# EAGLE schematic template (EAGLE 7.0.0)
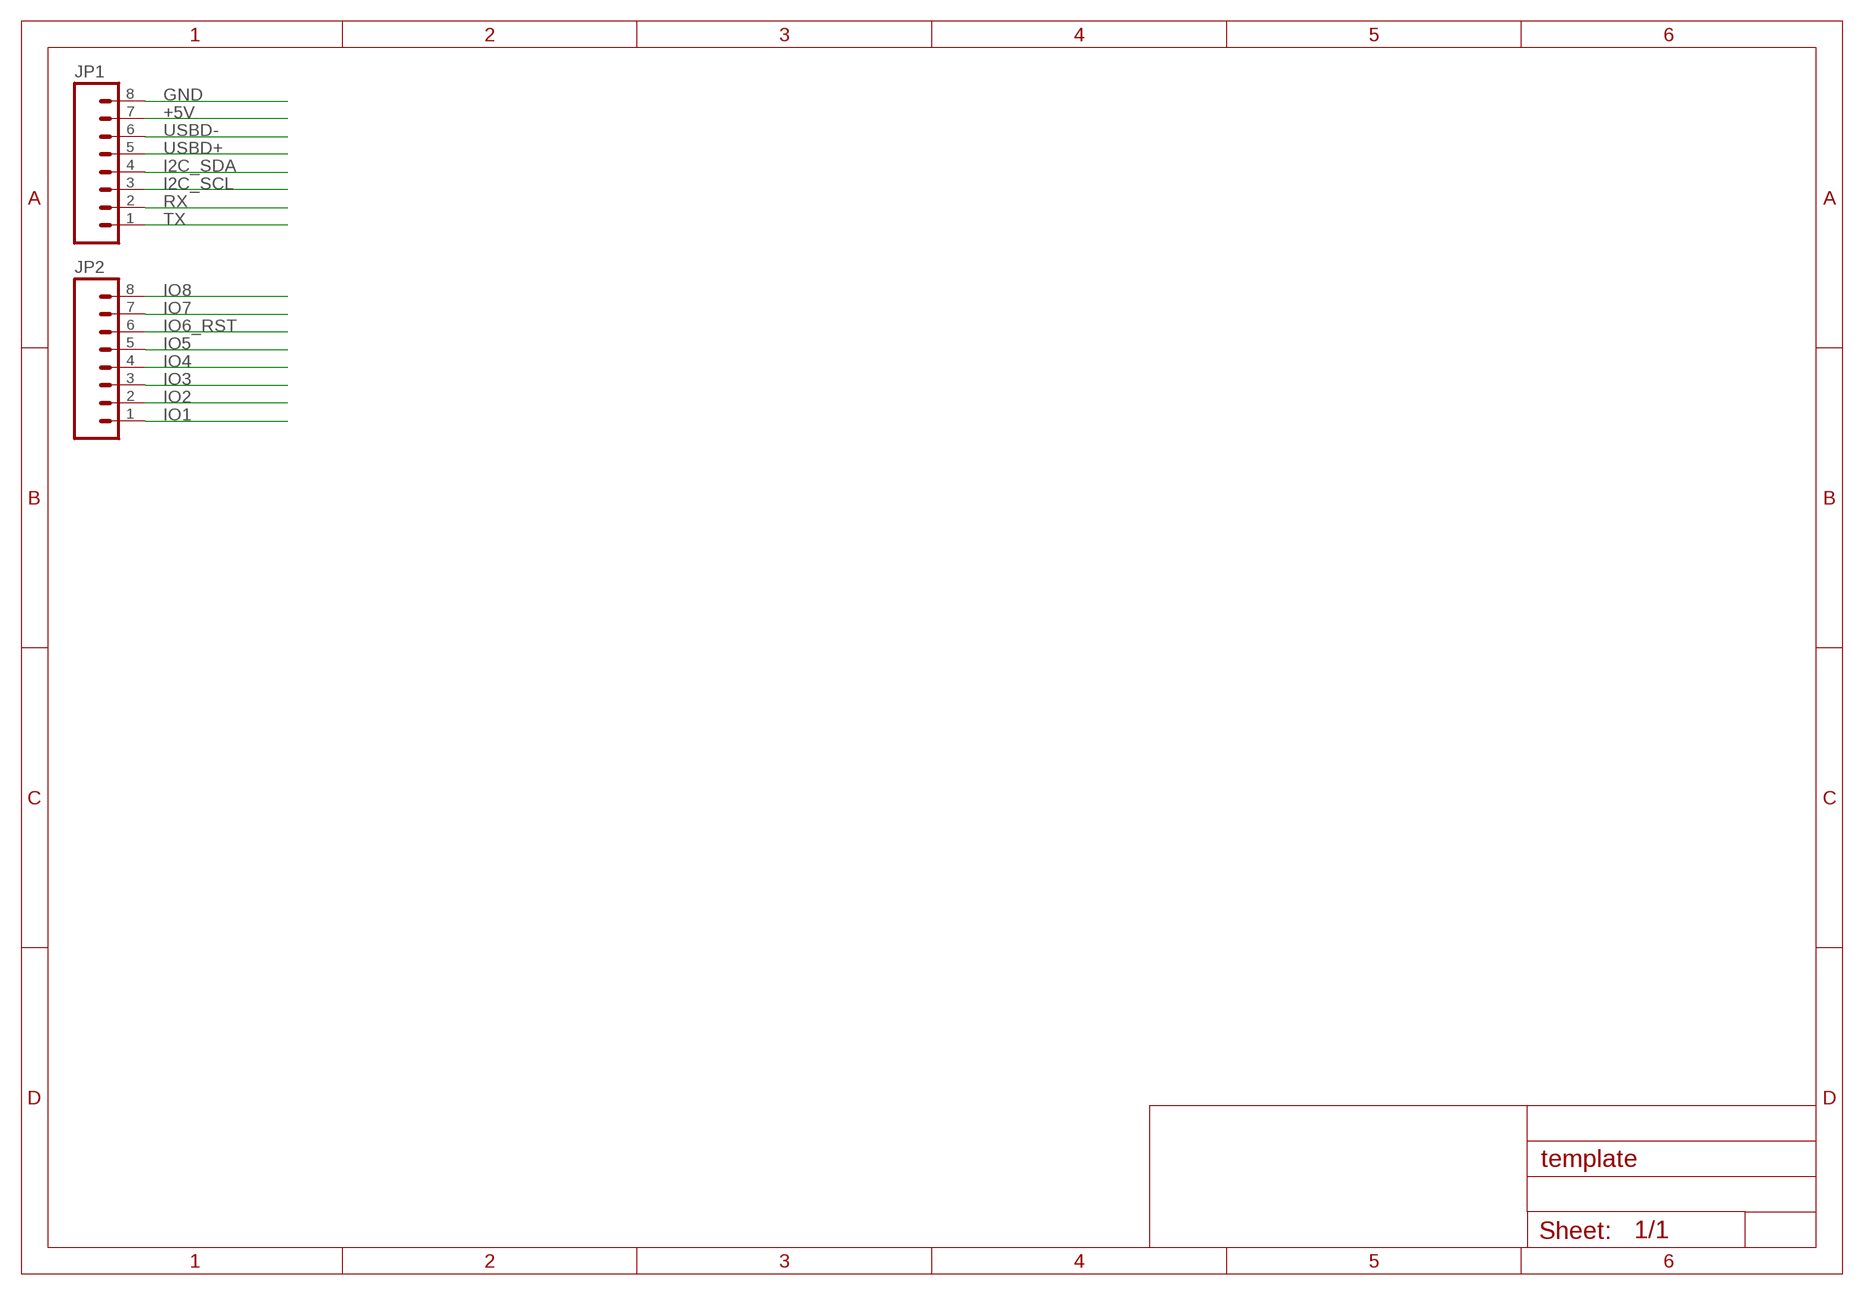
[diagram p0: schematic, sheet 1]

## Parts
JP1  M081X08  [1X08]
JP2  M081X08  [1X08]

## Nets
+5V: JP1.7
GND: JP1.8
I2C_SCL: JP1.3
I2C_SDA: JP1.4
IO1: JP2.1
IO2: JP2.2
IO3: JP2.3
IO4: JP2.4
IO5: JP2.5
IO6_RST: JP2.6
IO7: JP2.7
IO8: JP2.8
RX: JP1.2
TX: JP1.1
USBD+: JP1.5
USBD-: JP1.6

## Library data of the parts
JP1 JP2 = SparkFun-Connectors:M08: Header 8 Standard 8-pin 0.1" header. Use with straight break away headers (SKU : PRT-00116), right angle break away headers (PRT-00553), swiss pins (PRT-00743), machine pins (PRT-00117), and female headers (PRT-00115).